# EAGLE design cloak (EAGLE 6.5.0)
Rionita inn - Base board for 700-series
AUTHOR: Niclas Hedhman; REVISION: B
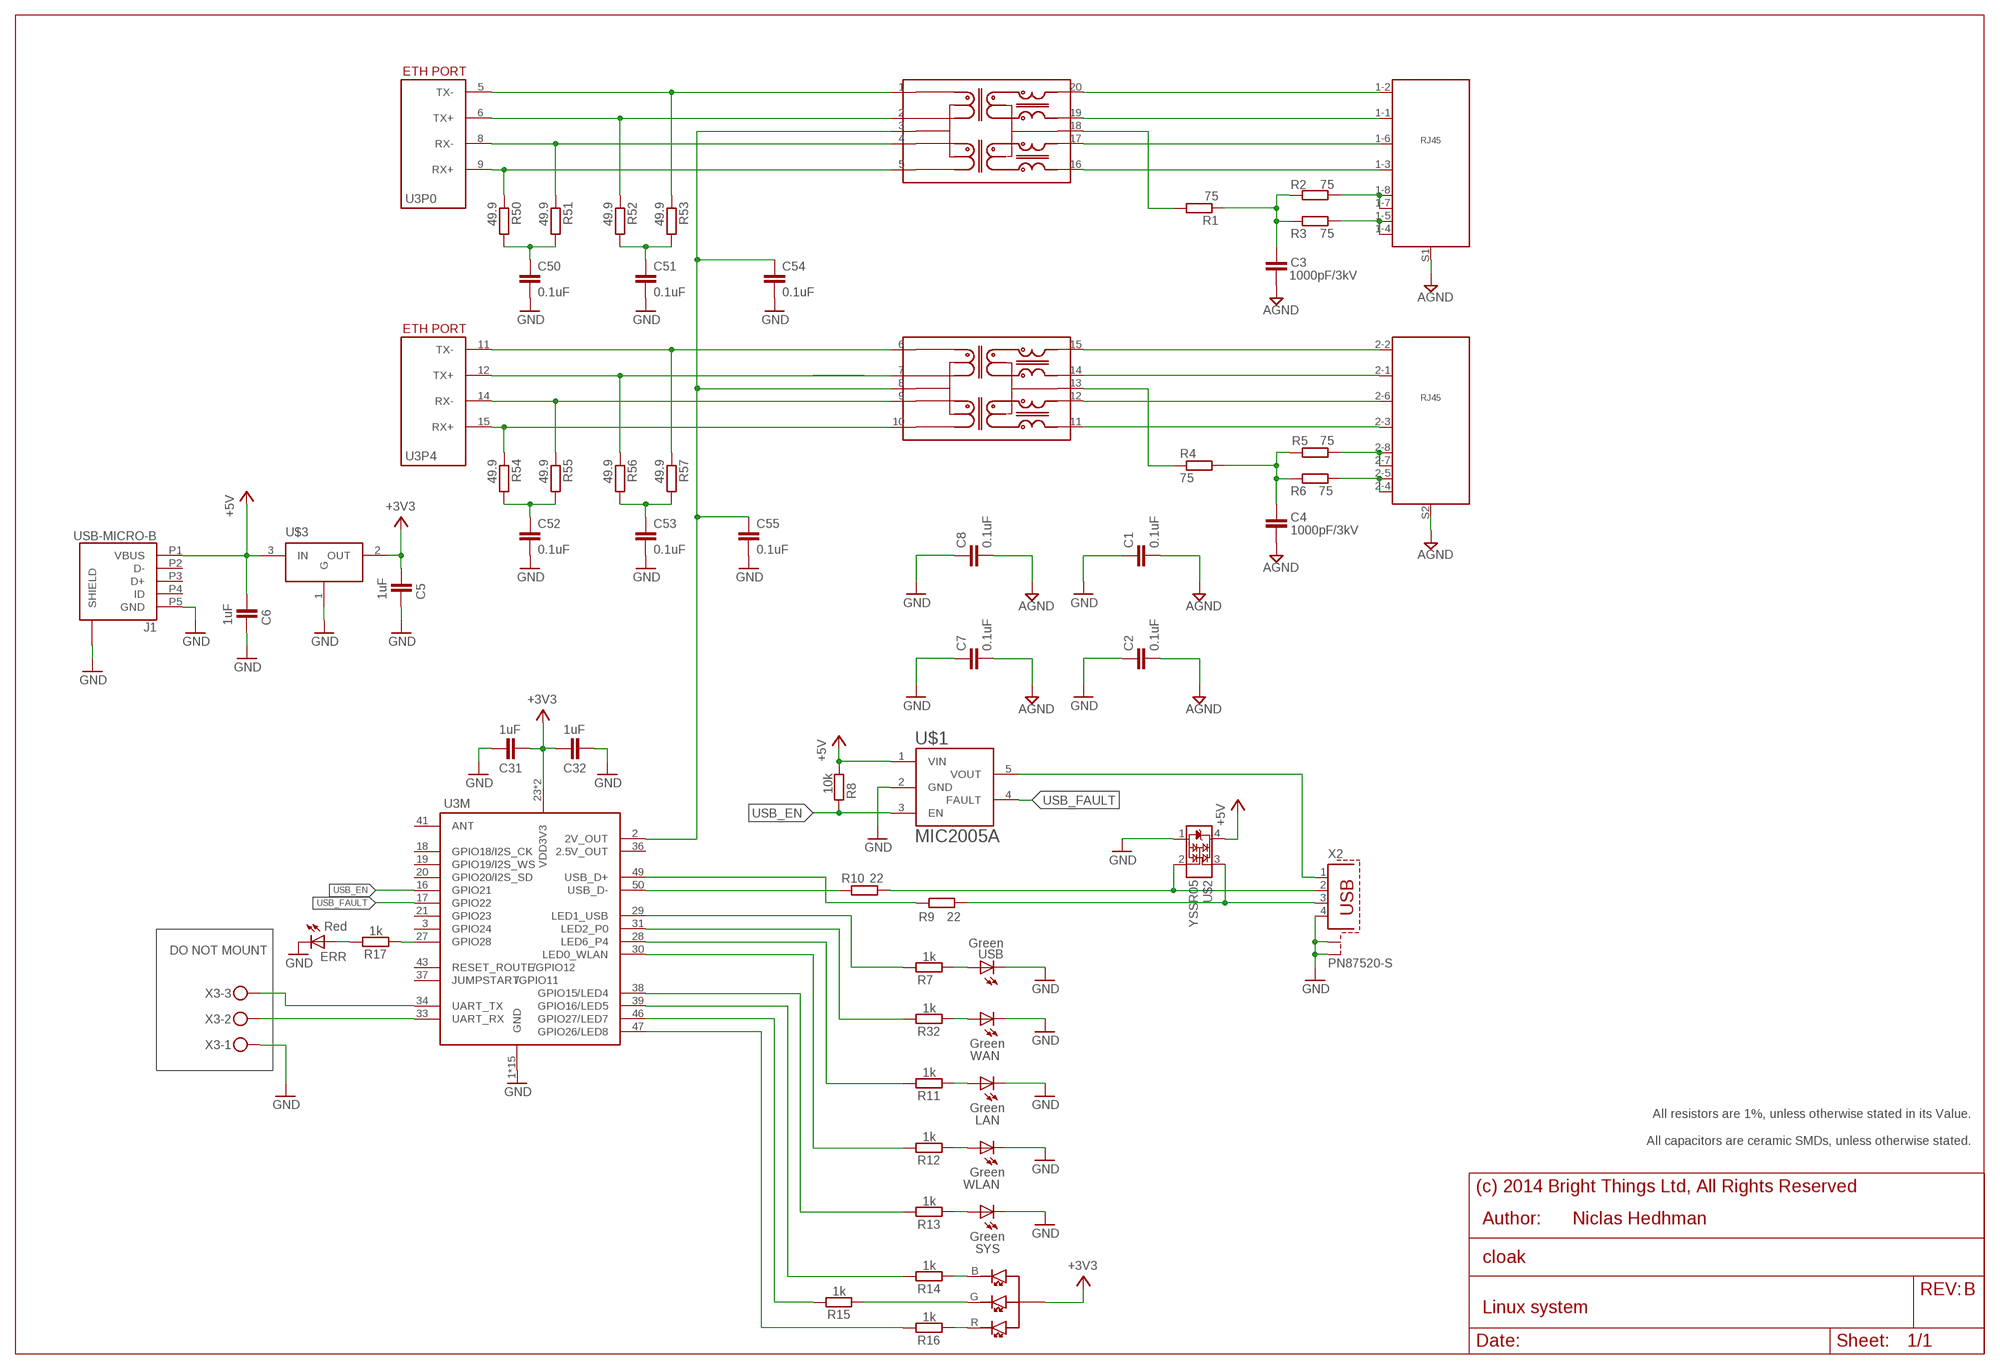
[diagram p0: schematic, sheet 1]
FRAME3 (DINA3_L): SHEET_DESCRIPTION: Linux system

## Parts
C1  0.1uF  C-EUC0603  [C0603]
C2  0.1uF  C-EUC0603  [C0603]
C3  1000pF/3kV  C-EUC1808  [C1808]
C4  1000pF/3kV  C-EUC1808  [C1808]
C5  1uF  C-EUC0603  [C0603]
C6  1uF  C-EUC0603  [C0603]
C7  0.1uF  C-EUC0603  [C0603]
C8  0.1uF  C-EUC0603  [C0603]
C31  1uF  C-EUC0603  [C0603]
C32  1uF  C-EUC0603  [C0603]
C50  0.1uF  C-EUC0603  [C0603]
C51  0.1uF  C-EUC0603  [C0603]
C52  0.1uF  C-EUC0603  [C0603]
C53  0.1uF  C-EUC0603  [C0603]
C54  0.1uF  C-EUC0603  [C0603]
C55  0.1uF  C-EUC0603  [C0603]
CLOAK  LTST-C19FD1WT  [LTST-C19FD1WT]
ERR  Red  LEDCHIP-LED0603  [CHIP-LED0603]
J1  USB-MICRO-B  [CON2_USB_MICRO_B_AT]
LAN  Green  LEDCHIP-LED0603  [CHIP-LED0603]
P4  ETHERNET_2PORT  [SJA-1X2]
R1  75  R-EU_R0805  [R0805]
R2  75  R-EU_R0805  [R0805]
R3  75  R-EU_R0805  [R0805]
R4  75  R-EU_R0805  [R0805]
R5  75  R-EU_R0805  [R0805]
R6  75  R-EU_R0805  [R0805]
R7  1k  R-EU_R0603  [R0603]
R8  10k  R-EU_R0603  [R0603]
R9  22  R-EU_R0805  [R0805]
R10  22  R-EU_R0805  [R0805]
R11  1k  R-EU_R0603  [R0603]
R12  1k  R-EU_R0603  [R0603]
R13  1k  R-EU_R0603  [R0603]
R14  1k  R-EU_R0603  [R0603]
R15  1k  R-EU_R0603  [R0603]
R16  1k  R-EU_R0603  [R0603]
R17  1k  R-EU_R0603  [R0603]
R32  1k  R-EU_R0603  [R0603]
R50  49.9  R-EU_R0805  [R0805]
R51  49.9  R-EU_R0805  [R0805]
R52  49.9  R-EU_R0805  [R0805]
R53  49.9  R-EU_R0805  [R0805]
R54  49.9  R-EU_R0805  [R0805]
R55  49.9  R-EU_R0805  [R0805]
R56  49.9  R-EU_R0805  [R0805]
R57  49.9  R-EU_R0805  [R0805]
SYS  Green  LEDCHIP-LED0603  [CHIP-LED0603]
TR1  HST2038DR  [H2038]
U3  DRAGINO_HE  [DRAGINO_HE]
U$1  MIC2005A  [SOT-23-5]
U$2  YSSR05  [YSSR05]
U$3  LDO_REGL  [SOT23]
USB  Green  LEDCHIP-LED0603  [CHIP-LED0603]
WAN  Green  LEDCHIP-LED0603  [CHIP-LED0603]
WLAN  Green  LEDCHIP-LED0603  [CHIP-LED0603]
X2  PN87520-S  [PN87520-S]
X3  MKDSN1,5/3-5,08  [MKDSN1,5/3-5,08]

## Nets
2V: C54.1 C55.1 TR1.3(CT1) TR1.8(CT1) U3.2(M:2V_OUT)
+3V3 [power]: C5.1 C31.1 C32.1 CLOAK.A U3.23(M:VDD3V3) U3.24(M:VDD3V3) U$3.2(OUT)
+5V: C6.1 J1.P1(VBUS) R8.2 U$1.1(VIN) U$2.4(+) U$3.3(IN)
AGND: C1.2 C2.2 C3.2 C4.2 C7.2 C8.2 P4.S1(SHIELD) P4.S2(SHIELD)
GND: C1.1 C2.1 C5.2 C6.2 C7.1 C8.1 C31.2 C32.2 C50.2 C51.2 C52.2 C53.2 C54.2 C55.2 ERR.C J1.P5(GND) J1.S1(SHIELD) J1.S2(SHIELD) J1.S3(SHIELD) J1.S4(SHIELD) J1.S5(SHIELD) J1.S6(SHIELD) LAN.C SYS.C U3.1(M:GND) U3.4(M:GND) U3.7(M:GND) U3.10(M:GND) U3.13(M:GND) U3.22(M:GND) U3.25(M:GND) U3.26(M:GND) U3.32(M:GND) U3.35(M:GND) U3.40(M:GND) U3.42(M:GND) U3.44(M:GND) U3.45(M:GND) U3.48(M:GND) U$1.2(GND) U$2.1(C) U$3.1(G) USB.C WAN.C WLAN.C X2.4 X2.S1 X2.S2 X3.1
N$1: R32.2 WAN.A
N$2: R7.2 USB.A
N$3: U$1.5(VOUT) X2.1
N$4: R10.2 U3.50(M:USB_D-)
N$5: R9.2 U3.49(M:USB_D+)
N$6: R10.1 U$2.2(B) X2.2
N$7: R9.1 U$2.3(A) X2.3
N$8: LAN.A R11.2
N$9: R12.2 WLAN.A
N$10: R13.2 SYS.A
N$11: CLOAK.B R14.2
N$12: R7.1 U3.29(M:LED1_USB)
N$13: R32.1 U3.31(M:LED2_P0)
N$14: R11.1 U3.28(M:LED6_P4)
N$15: R12.1 U3.30(M:LED0_WLAN)
N$16: R13.1 U3.38(M:LED4)
N$17: R14.1 U3.39(M:LED5)
N$18: CLOAK.G R15.2
N$19: CLOAK.R R16.2
N$20: R15.1 U3.46(M:LED7)
N$21: R16.1 U3.47(M:LED8)
N$22: ERR.A R17.1
N$23: C50.1 R50.2 R51.2
N$24: R17.2 U3.27(M:GPIO28)
N$25: C51.1 R52.2 R53.2
N$27: C52.1 R54.2 R55.2
N$39: C53.1 R56.2 R57.2
N$44: P4.1-2 TR1.20(TX+)
N$45: P4.1-1 TR1.19(TX-)
N$46: P4.1-6 TR1.17(RX+)
N$47: P4.1-3 TR1.16(RX-)
N$60: P4.1-7 P4.1-8 R2.1
N$61: P4.1-4 P4.1-5 R3.1
N$62: P4.2-7 P4.2-8 R5.1
N$63: P4.2-4 P4.2-5 R6.2
N$64: C4.1 R4.2 R5.2 R6.1
N$65: C3.1 R1.1 R2.2 R3.2
N$70: P4.2-2 TR1.15(TX+)
N$71: P4.2-1 TR1.14(TX-)
N$72: P4.2-6 TR1.12(RX+)
N$73: P4.2-3 TR1.11(RX-)
N$74: R4.1 TR1.13(CT2)
N$75: R1.2 TR1.18(CT2)
P0-RX+: R50.1 TR1.5(RD-) U3.9(P0:RX+)
P0-RX-: R51.1 TR1.4(RD+) U3.8(P0:RX-)
P0-TX+: R52.1 TR1.2(TD-) U3.6(P0:TX+)
P0-TX-: R53.1 TR1.1(TD+) U3.5(P0:TX-)
P4-RX+: R54.1 TR1.10(RD-) U3.15(P4:RX+)
P4-RX-: R55.1 TR1.9(RD+) U3.14(P4:RX-)
P4-TX+: R56.1 TR1.7(TD-) U3.12(P4:TX+)
P4-TX-: R57.1 TR1.6(TD+) U3.11(P4:TX-)
RX: U3.33(M:UART_RX) X3.2
TX: U3.34(M:UART_TX) X3.3
USB_EN: R8.1 U3.16(M:GPIO21) U$1.3(EN)
USB_FAULT: U3.17(M:GPIO22) U$1.4(FAULT)
Unconnected: J1.P2(D-) J1.P3(D+) J1.P4(ID) U3.3(M:GPIO24) U3.18(M:GPIO18) U3.19(M:GPIO19) U3.20(M:GPIO20) U3.21(M:GPIO23) U3.37(M:JUMPSTART) U3.41(M:ANT) U3.43(M:RESET_ROUTE)

## Notes on the sheet
- DO NOT MOUNT
- All resistors are 1%, unless otherwise stated in its Value.
  
  All capacitors are ceramic SMDs, unless otherwise stated.

## Power pins joined to a net without a drawn wire
2.5V_OUT: U3.36(M:2.5V_OUT)

## Library data of the parts
C1 C2 C7 C8 = rcl:C-EU: CAPACITOR, European symbol; DIGIKEY: C0603C104K5RAC7411; MANUFACTURER: Kemet; PARTNO: C0603C104K5RAC7411
C3 C4 = rcl:C-EU: CAPACITOR, European symbol; DIGIKEY: 399-7246-2-ND; DIGIKEY_LOW: 399-7246-6-ND; MANUFACTURER: Kemet; PARTNO: C1808C102KHRACTU
C5 C6 C31 C32 = rcl:C-EU: CAPACITOR, European symbol; DIGIKEY: 399-3118-2-ND; DIGIKEY_LOW: 399-3118-6-ND; MF: Kemet; MPN: C0603C105K8PACTU
C50-C55 = rcl:C-EU: CAPACITOR, European symbol; DIGIKEY: 399-7374-2-ND; MF: Kemet; MPN: C0603C104K5RAC7411
CLOAK = RioNet:LTST-C19FD1WT; DIGIKEY: 160-2022-2-ND; MF: Lite-On Inc; MPN: LTST-C19FD1WT
ERR LAN SYS USB WAN WLAN = led:LED: LED OSRAM: - CHIPLED LG R971, LG N971, LY N971, LG Q971, LY Q971, LO R971, LY R971 LH N974, LH R974 LS Q976, LO Q976, LY Q976 LO Q996 - Hyper CHIPLED LW Q18S LB Q993, LB Q99A, LB R99A - SideLED LS A670, LO A670, LY A670, LG A670, LP A670 LB A673, LV A673, LT A673, LW A673 LH A674 LY A675 LS A676, LA A676, LO A676, LY A676, LW A676 LS A679, LY A679, LG A679 - Hyper Micro SIDELED® LS Y876, LA Y876, LO Y876, LY Y876 LT Y87S - SmartLED LW L88C, LW L88S LB L89C, LB L89S, LG L890 LS L89K, LO L89K, LY L89K LS L896, LA L896, LO L896, LY L896 - TOPLED LS T670, LO T670, LY T670, LG T670, LP T670 LSG T670, LSP T670, LSY T670, LOP T670, LYG T670 LG T671, LOG T671, LSG T671 LB T673, LV T673, LT T673, LW T673 LH T674 LS T676, LA T676, LO T676, LY T676, LB T676, LH T676, LSB T676, LW T676 LB T67C, LV T67C, LT T67C, LS T67K, LO T67K, LY T67K, LW E67C LS E67B, LA E67B, LO E67B, LY E67B, LB E67C, LV E67C, LT E67C LW T67C LS T679, LY T679, LG T679 LS T770, LO T770, LY T770, LG T770, LP T770 LB T773, LV T773, LT T773, LW T773 LH T774 LS E675, LA E675, LY E675, LS T675 LS T776, LA T776, LO T776, LY T776, LB T776 LHGB T686 LT T68C, LB T68C - Hyper Mini TOPLED® LB M676 - Mini TOPLED Santana® LG M470 LS M47K, LO M47K, LY M47K Source: http://www.osram.convergy.de LUXEON: - LUMILED® LXK2-PW12-R00, LXK2-PW12-S00, LXK2-PW14-U00, LXK2-PW14-V00 LXK2-PM12-R00, LXK2-PM12-S00, LXK2-PM14-U00 LXK2-PE12-Q00, LXK2-PE12-R00, LXK2-PE12-S00, LXK2-PE14-T00, LXK2-PE14-U00 LXK2-PB12-K00, LXK2-PB12-L00, LXK2-PB12-M00, LXK2-PB14-N00, LXK2-PB14-P00, LXK2-PB14-Q00 LXK2-PR12-L00, LXK2-PR12-M00, LXK2-PR14-Q00, LXK2-PR14-R00 LXK2-PD12-Q00, LXK2-PD12-R00, LXK2-PD12-S00 LXK2-PH12-R00, LXK2-PH12-S00 LXK2-PL12-P00, LXK2-PL12-Q00, LXK2-PL12-R00 Source: www.luxeon.com KINGBRIGHT: KA-3528ASYC Source: www.kingbright.com; DIGIKEY: 475-1410-2-ND; DIGIKEY_LOW: 475-1409-6-ND; MF: OSRAM Opto Semiconductors Inc; MPN: LG Q971-KN-1
J1 = RioNet:USB-MICRO-B
P4 = RioNet:ETHERNET_2PORT
R1-R6 = resistor:R-EU_: RESISTOR, European symbol; DIGIKEY: 541-75.0HTR-ND; DIGIKEY_LOW: 541-75.0HDKR-ND; MANUFACTURER: Vishay Dale; PARTNO: CRCW060375R0FKEA
R7 R11-R17 R32 = rcl:R-EU_: RESISTOR, European symbol; DIGIKEY: 541-1KGTR-ND; DIGIKEY_LOW: 541-1KGDKR-ND; MF: Vishay Dale; MPN: CRCW06031K0JNEA
R8 = rcl:R-EU_: RESISTOR, European symbol; MF: Vishay Dale
R9 R10 = resistor:R-EU_: RESISTOR, European symbol; DIGIKEY: 541-22.0HTR-ND; DIGIKEY_LOW: 541-22.0HDKR-ND; MANUFACTURER: Vishay Dale; PARTNO: CRCW060322R0FKEA
R50-R57 = resistor:R-EU_: RESISTOR, European symbol; DIGIKEY: 541-49.9HTR-ND; DIGIKEY_LOW: 541-49.9HDKR-ND; MF: Vishay Dale; MPN: CRCW060349R9FKEA
TR1 = RioNet:HST2038DR; SUPPLIER: Dragino
U3 = RioNet:DRAGINO_HE: Dragino HE Module
U$1 = RioNet:MIC2005A
U$2 = RioNet:YSSR05: High Speed Protection Diod Array
U$3 = RioNet:LDO_REGL; DIGIKEY: AP2120N-3.3TRG1DITR-ND; MF: Diodes Inc; MPN: AP2120N-3.3TRG1
X2 = con-berg:PN87520-S; OC_FARNELL: unknown; OC_NEWARK: unknown
X3 = con-phoenix-508:MKDSN1,5/3-5,08: MKDSN 1,5/ 3-5,08 Printklemme Nennstrom: 13,5 A Nennspannung: 250 V Rastermaß: 5,08 mm Polzahl: 3 Anschlussart: Schraubanschluss Montage: Löten Anschlussrichtung Leiter/Platine: 0 ° Artikelnummer: 1729131 Source: http://eshop.phoenixcontact.com .. 1729131.pdf; MPN: SMKDSN1,5/3-5,08; OC_FARNELL: 1792904; OC_NEWARK: 70R0299

## Net classes
0 default: width 0.152 mm, drill 0.33 mm, clearance 0.152 mm
1 power: width 0.254 mm, drill 0.61 mm, clearance 0.178 mm
2 gnd: width 0.254 mm, drill 0.61 mm, clearance 0.178 mm
3 usbvcc: width 0.406 mm, drill 0.61 mm, clearance 0.178 mm
4 aref: width 0.254 mm, drill 0.33 mm, clearance 0.152 mm
5 external: width 0.813 mm, drill 1.27 mm, clearance 0.305 mm

## Board
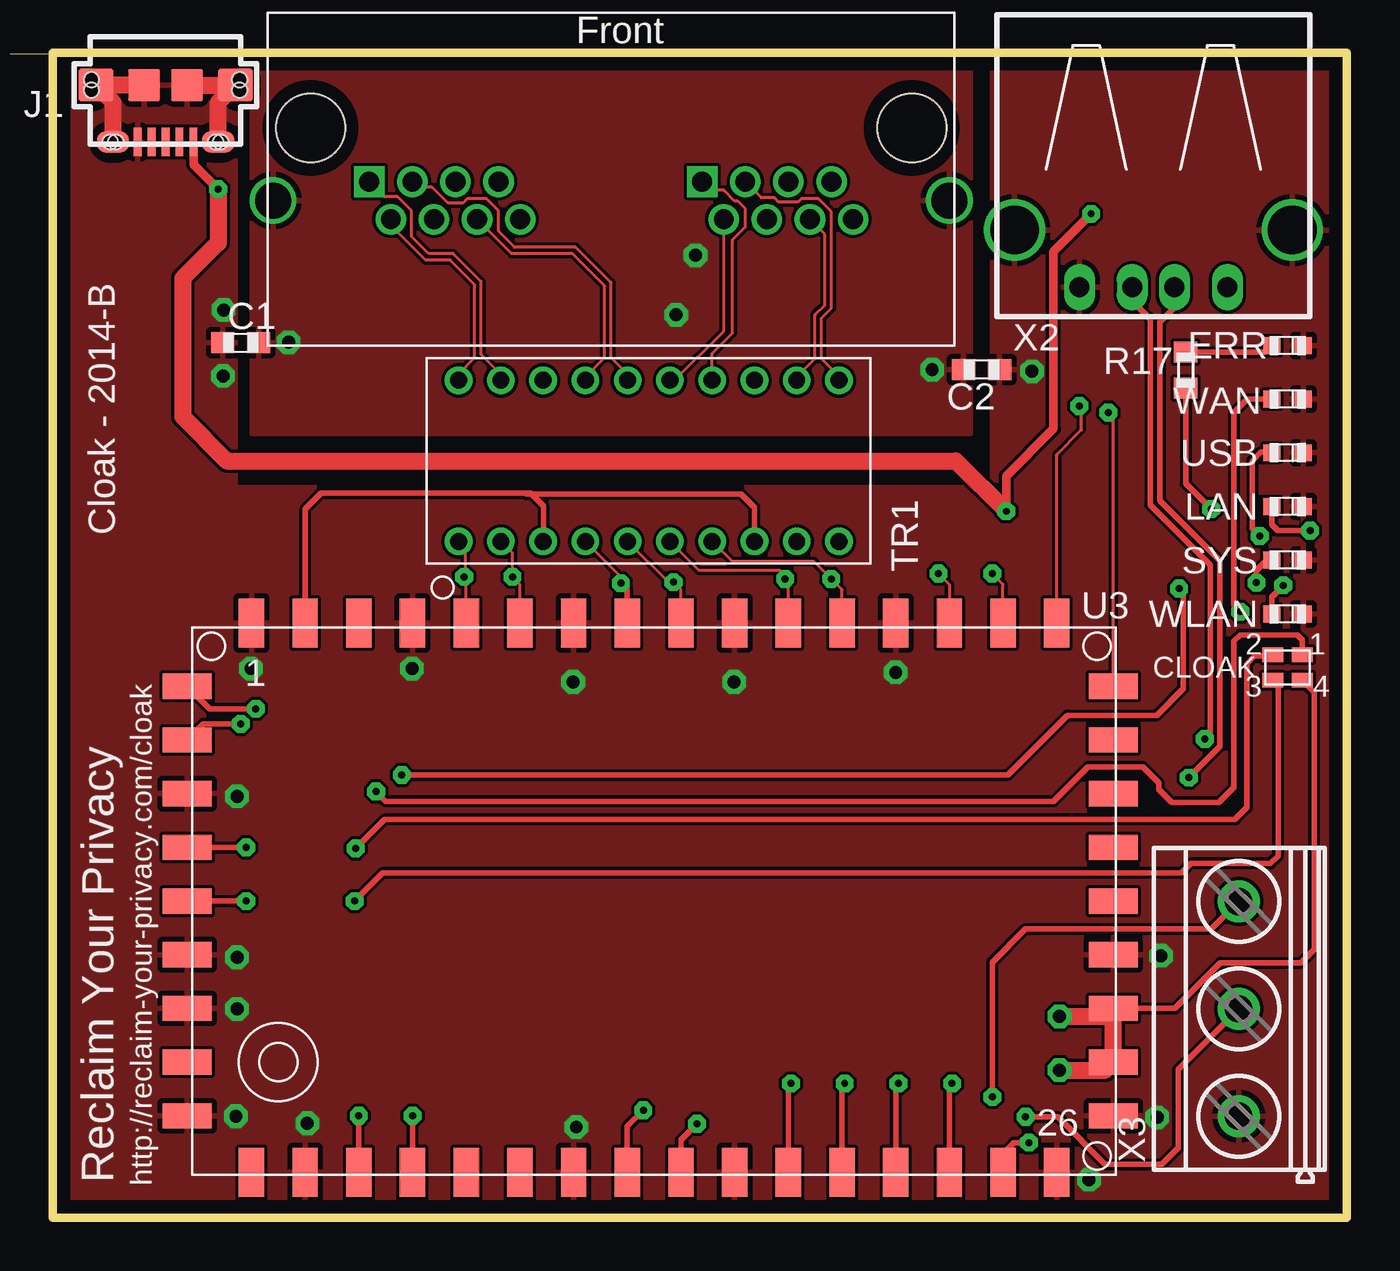
[diagram p1: board, top side]
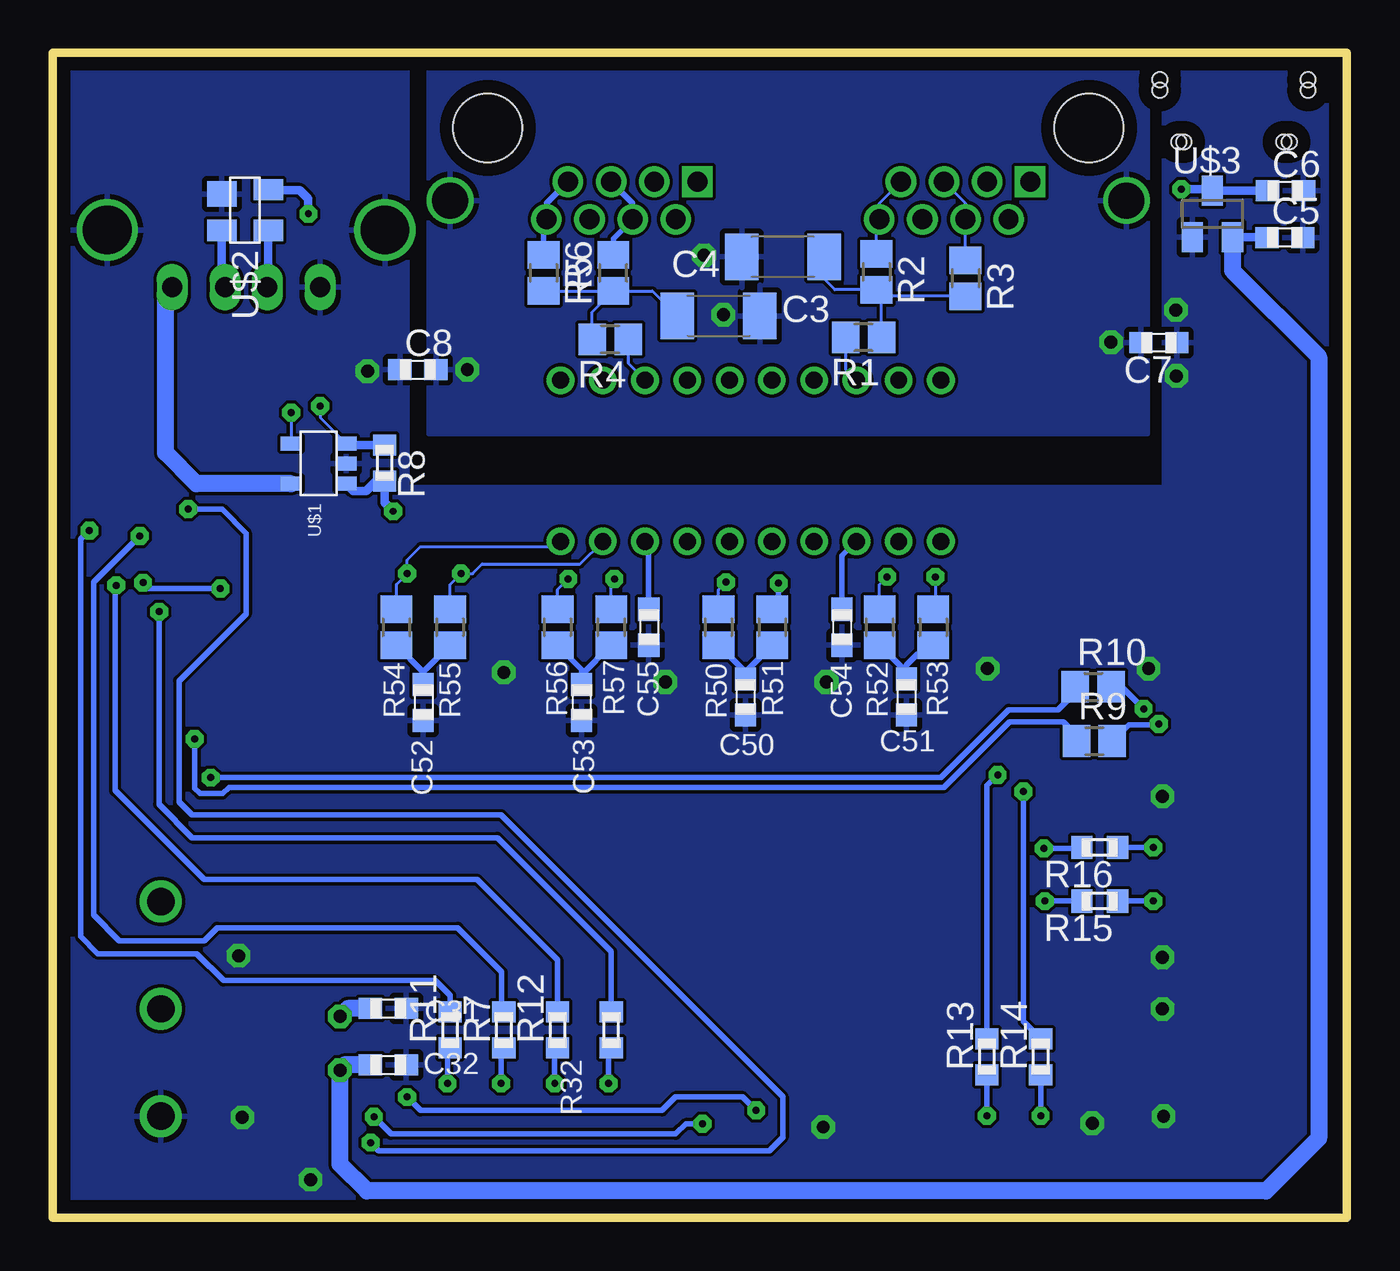
[diagram p2: board, bottom side, seen from below]

Size 61.21 x 55.12 mm. Coordinates in mm from the lower left corner, seen from the top.
Outline: 0,0 61.21,0 61.21,55.12 0,55.12 0,0
Copper layers (1*16): Top 0.035mm / dielectric 1.53mm / Bottom 0.035mm
Design rules "default *": minimum track width 6mil, minimum drill 13mil, track to track 6mil, track to pad 6mil, pad to pad 6mil, via to via 6mil, smd to smd 6mil, copper to edge 25mil, drill to drill 12mil, minimum pad ring 10mil, minimum via ring 10mil, stop-mask expansion 2mil, vias tented up to drill 30mil, thermal gap 10mil
tRestrict: area 125.7,6.1 to 134,13.1; area 88.3,6.2 to 94.5,16.6; area 104.4,13.8 to 108.7,19.4; area 112.5,13.6 to 118.9,14.9; area 111.3,13.6 to 115.8,18.9
bRestrict: area 125.7,6.1 to 134,13.1; area 89.5,6.2 to 94.5,16.3; area 97.5,8.3 to 117.3,19.4

### Footprints (pad centres in the part's own frame; a part is rotated, then mirrored left to right if it is on the bottom)
C0603 = smd 1.1 x 1: 1 -0.85,0; 2 0.85,0
C1808 = smd 1.6 x 2.2: 1 -1.95,0; 2 1.95,0
LTST-C19FD1WT = smd 1 x 0.7: A 0.7,-0.6; B 0.7,0.6; G -0.7,-0.6; R -0.7,0.6
CHIP-LED0603 = smd 0.8 x 0.8: A 0,-0.75; C 0,0.75
CON2_USB_MICRO_B_AT = smd 0.406 x 1.346: P1 -1.321,2.692; P2 -0.66,2.692; P3 0,2.692; P4 0.66,2.692; P5 1.321,2.692 | smd 1.651 x 1.549: S1 -3.302,0; S2 3.302,0 | smd 1.524 x 1.016: S3 -2.489,2.692; S4 2.489,2.692 | smd 1.524 x 1.524: S5 -1.016,0; S6 1.016,0 | hole 0.7: -3.505,0.254; -3.505,-0.254; 3.505,0.254; 3.505,-0.254; -2.616,2.692; -2.362,2.692; 2.362,2.692; 2.616,2.692
SJA-1X2 = drill 0.94 pad 1.27 square: 1-1 11.445,2.54; 2-1 -4.305,2.54 | drill 0.94 pad 1.27: 1-2 10.425,4.32; 1-3 9.405,2.54; 1-4 8.385,4.32; 1-5 7.365,2.54; 1-6 6.345,4.32; 1-7 5.325,2.54; 1-8 4.305,4.32; 2-2 -5.325,4.32; 2-3 -6.345,2.54; 2-4 -7.365,4.32; 2-5 -8.385,2.54; 2-6 -9.405,4.32; 2-7 -10.425,2.54; 2-8 -11.445,4.32 | drill 1.7: S1 16,3.43; S2 -16,3.43 | hole 3.25: -14.225,0; 14.225,0
R0805 = smd 1.3 x 1.5: 1 -0.85,0; 2 0.85,0
R0603 = smd 1 x 1.1: 1 -0.85,0; 2 0.85,0
H2038 = drill 0.8: 1 -3.81,9; 2 -3.81,7; 3 -3.81,5; 4 -3.81,3; 5 -3.81,1; 6 -3.81,-1; 7 -3.81,-3; 8 -3.81,-5; 9 -3.81,-7; 10 -3.81,-9; 11 3.81,-9; 12 3.81,-7; 13 3.81,-5; 14 3.81,-3; 15 3.81,-1; 16 3.81,1; 17 3.81,3; 18 3.81,5; 19 3.81,7; 20 3.81,9
DRAGINO_HE = smd 1.2 x 2.3: 1 -19.05,13.152; 2 -16.51,13.152; 3 -13.97,13.152; 4 -11.43,13.152; 5 -8.89,13.152; 6 -6.35,13.152; 7 -3.81,13.152; 8 -1.27,13.152; 9 1.27,13.152; 10 3.81,13.152; 11 6.35,13.152; 12 8.89,13.152; 13 11.43,13.152; 14 13.97,13.152; 15 16.51,13.152; 16 19.05,13.152; 26 19.05,-12.835; 27 16.51,-12.835; 28 13.97,-12.835; 29 11.43,-12.835; 30 8.89,-12.835; 31 6.35,-12.835; 32 3.81,-12.835; 33 1.27,-12.835; 34 -1.27,-12.835; 35 -3.81,-12.835; 36 -6.35,-12.835; 37 -8.89,-12.835; 38 -11.43,-12.835; 39 -13.97,-12.835; 40 -16.51,-12.835; 41 -19.05,-12.835 | smd 2.3 x 1.2: 17 21.725,10.16; 18 21.725,7.62; 19 21.725,5.08; 20 21.725,2.54; 21 21.725,0; 22 21.725,-2.54; 23 21.725,-5.08; 24 21.725,-7.62; 25 21.725,-10.16; 42 -22.09,-10.16; 43 -22.09,-7.62; 44 -22.09,-5.08; 45 -22.09,-2.54; 46 -22.09,0; 47 -22.09,2.54; 48 -22.09,5.08; 49 -22.09,7.62; 50 -22.09,10.16
SOT-23-5 = smd 0.66 x 1: 1 0.95,1.3; 2 0,1.3; 3 -0.95,1.3; 4 -0.95,-1.3; 5 0.95,-1.3
YSSR05 = smd 1.2 x 1.4: 1 -0.76,-1.1 | smd 1 x 1.4: 2 0.96,-1.1; 3 0.96,1.1; 4 -0.96,1.1
SOT23 = smd 1 x 1.4: 1 -0.95,-1.1; 2 0.95,-1.1; 3 0,1.1
PN87520-S = drill 0.95 long: 1 -3.5,2.71; 2 -1,2.71; 3 1,2.71; 4 3.5,2.71 | drill 2.3 pad 2.9: S1 -6.57,0; S2 6.57,0
MKDSN1,5/3-5,08 = drill 1.3 pad 2: 1 -7.641,0.025; 2 -2.561,0.025; 3 2.519,0.025

### Placement (x,y rotation side)
C1  8.89,41.4 0 top
C2  43.94,40.13 180 top
C3  26.67,45.47 180 bottom
C4  29.72,42.67 0 bottom
C5  2.92,46.38 0 bottom
C6  2.9,48.59 0 bottom
C7  8.89,41.4 180 bottom
C8  43.94,40.13 0 bottom
C31  45.34,9.91 0 bottom
C32  45.34,7.24 0 bottom
C50  28.45,24.64 270 bottom
C51  20.83,24.64 270 bottom
C52  43.69,24.38 270 bottom
C53  36.2,24.38 270 bottom
C54  23.88,27.94 270 bottom
C55  33.02,27.94 270 bottom
CLOAK  58.42,26.04 0 top
ERR  58.42,41.27 270 top
J1  5.33,53.59 180 top
LAN  58.42,33.66 270 top
P4  26.42,51.56 180 top
R1  22.86,41.66 180 bottom
R2  22.25,44.75 270 bottom
R3  18.03,44.45 270 bottom
R4  34.85,41.55 180 bottom
R5  38,44.7 270 bottom
R6  34.7,44.7 90 bottom
R7  39.88,8.89 90 bottom
R8  45.52,35.71 270 bottom
R9  11.94,22.56 0 bottom
R10  11.99,25.12 0 bottom
R11  42.42,8.89 90 bottom
R12  37.34,8.89 90 bottom
R13  17.02,7.62 90 bottom
R14  14.48,7.62 90 bottom
R15  11.68,14.99 180 bottom
R16  11.68,17.53 180 bottom
R17  53.59,40.11 270 top
R32  34.8,8.89 90 bottom
R50  29.72,27.94 270 bottom
R51  27.18,27.94 270 bottom
R52  22.1,27.94 270 bottom
R53  19.56,27.94 270 bottom
R54  44.96,27.94 270 bottom
R55  42.42,27.94 270 bottom
R56  37.34,27.94 270 bottom
R57  34.8,27.94 270 bottom
SYS  58.42,31.11 270 top
TR1  28.19,35.81 90 top
U3  28.45,14.99 0 top
U$1  48.64,35.69 270 bottom
U$2  52.12,47.68 270 bottom
U$3  6.35,47.5 0 bottom
USB  58.42,36.2 270 top
WAN  58.42,38.73 270 top
WLAN  58.42,28.57 270 top
X2  52.07,46.74 180 top
X3  56.13,12.45 90 top

### Tracks (layer width: path | path; a pad name or v marks a point on that pad's centre or on a via)
2V
  Top 0.254: U3.2 11.94,33.53 12.7,34.29 22.35,34.29 | 22.35,34.29 22.61,34.29 23.22,33.68 23.22,32.03 TR1.3 | TR1.8 33.19,33.61 32.56,34.24 22.4,34.24 22.35,34.29
  Bottom 0.254: C54.1 23.88,31.32 TR1.3 | C55.1 33.02,31.83 TR1.8
+3V3  (via drill 0.61)
  Top 0.254: 49.79,6.99 U3.24 | 49.79,9.53 U3.23 53.09,9.91 55.24,12.06 59.05,12.06 59.69,12.7 59.69,24.86 CLOAK.A
  Top 0.813: v47.62,6.99 49.79,6.99 | v47.62,9.53 49.79,9.53 | U3.24 U3.23
  Bottom 0.406: U$3.2 3.79,46.4 C5.1
  Bottom 0.813: C32.1 47.37,7.24 v47.62,6.99 47.62,2.54 46.35,1.27 3.81,1.27 1.32,3.76 1.32,40.74 5.4,44.82 U$3.2 | C31.1 47.24,9.91 v47.62,9.53
+5V  (via drill 0.33)
  Top 0.406: J1.P1 6.66,49.84 v7.82,48.67 | v45.11,33.43 45.11,35.1 47.35,37.34 47.35,45.72 v49.12,47.5
  Top 0.813: v7.82,48.67 7.82,46.13 6.15,44.45 6.15,37.9 8.23,35.81 42.72,35.81 v45.11,33.43
  Bottom 0.406: v7.82,48.67 6.42,48.67 U$3.3 C6.1 | v45.11,33.43 45.52,33.83 R8.2 45.91,34.86 46.38,34.39 47,34.39 U$1.1 | v49.12,47.5 49.12,48.21 49.53,48.62 51,48.62 U$2.4
AGND  (via drill 0.61)
  other vias: 41.61,40.13 30.4,45.54 29.49,42.72 11.15,41.43
  pour Bottom: 9.4,37.08 43.43,37.08 43.43,56.64 9.4,56.64
  pour Top: 9.4,37.08 43.43,37.08 43.43,56.64 9.4,56.64
GND  (via drill 0.61)
  Top 0.813: J1.S5 J1.S1 7.82,52.78 J1.S3 | J1.S6 J1.S2 2.85,52.78 J1.S4
  other vias: 52.43,12.4 52.25,4.75 49.02,1.8 24.77,4.29 12.04,4.47 8.66,4.8 8.71,9.88 8.71,12.32 8.71,19.94 9.37,25.98 16.99,25.98 24.61,25.35 32.23,25.35 39.88,25.81 46.33,40.06 8.08,42.95 8.05,39.83
  pour Bottom: -1.27,-1.27 -1.27,57.15 8.64,57.15 8.64,34.54 44.45,34.54 44.45,57.66 61.72,57.66 61.72,-1.27
  pour Top: -1.27,-2.54 -1.27,56.13 8.64,56.13 8.64,34.54 44.45,34.54 44.45,56.64 62.23,56.9 62.23,-2.29
N$1  (via drill 0.33)
  Top 0.254: v56.19,28.68 55.88,28.98 55.88,38.1 56.52,38.73 WAN.A
  Bottom 0.254: v56.19,28.68 56.19,19.56 54.61,17.98 40.18,17.98 34.8,12.6 R32.2
N$2  (via drill 0.33)
  Top 0.152: 57.65,36.22 USB.A
  Top 0.254: v57.1,32.26 56.74,32.61 56.74,35.81 57.15,36.22 57.65,36.22
  Bottom 0.152: 39.98,9.84 R7.2
  Bottom 0.254: 39.98,9.84 39.98,11.63 42.06,13.72 53.44,13.72 54.05,13.11 58.06,13.11 59.28,14.33 59.28,30.07 v57.1,32.26
N$3
  Bottom 0.813: U$1.5 54.42,34.74 55.88,36.2 55.88,43.72 X2.1
N$4  (via drill 0.33)
  Top 0.254: v9.6,24.08 7.42,24.08 U3.50
  Bottom 0.254: R10.2 10.64,25.12 v9.6,24.08
N$5  (via drill 0.33)
  Top 0.254: v8.89,23.37 7.12,23.37 U3.49
  Bottom 0.254: R9.2 11.07,22.55 10.31,23.32 8.94,23.32 v8.89,23.37
N$6  (via drill 0.33)
  Top 0.254: X2.2 53.07,43.06 52.38,42.37 52.38,33.93 55.22,31.09 55.22,22.3 v53.75,20.83
  Bottom 0.254: v53.75,20.83 19.2,20.83 16,24.03 13.66,24.03 13.11,24.59 13.11,24.85 R10.1 12.86,25.09
  Bottom 0.406: U$2.2 53.22,44.18 X2.2
N$7  (via drill 0.33)
  Top 0.254: X2.3 51.07,43.37 51.92,42.52 51.92,33.73 54.76,30.89 54.76,22.91 v54.51,22.66
  Bottom 0.254: v54.51,22.66 54.51,20.32 54.25,20.07 53.19,20.07 52.88,20.37 19.05,20.37 15.95,23.47 13.41,23.47 13.01,23.06 13.01,22.77 R9.1
  Bottom 0.406: U$2.3 51.02,44.08 X2.3
N$8  (via drill 0.33)
  Top 0.254: LAN.A 57.67,32.8 57.96,32.51 v59.49,32.51
  Bottom 0.254: R11.2 42.42,10.52 43.13,11.23 53.14,11.23 54.41,12.5 59.08,12.5 59.89,13.31 59.89,32.11 v59.49,32.51
N$9  (via drill 0.33)
  Top 0.254: WLAN.A 57.67,29.37 v58.22,29.92
  Bottom 0.254: R12.2 37.34,12.19 41.15,16 54.05,16 58.27,20.22 58.27,29.87 v58.22,29.92
N$10  (via drill 0.33)
  Top 0.152: 53.49,29.57 v53.29,29.77
  Top 0.254: v16.51,20.95 45.19,20.95 48.01,23.77 52.22,23.77 53.49,25.04 53.49,29.57 | SYS.A 57.43,31.11 56.95,30.63 v56.95,30.05
  Bottom 0.254: R13.2 17.02,20.45 v16.51,20.95 | v53.29,29.77 56.72,29.77 56.72,29.82 v56.95,30.05
N$11  (via drill 0.33)
  Top 0.254: v15.29,20.17 15.75,19.71 47.35,19.71 48.97,21.34 51.56,21.34 52.32,20.57 52.32,20.27 52.93,19.66 55.17,19.66 55.88,20.37 55.88,27.28 56.19,27.58 58.88,27.58 59.12,27.34 CLOAK.B
  Bottom 0.254: v15.29,20.17 15.29,9.28 R14.2
N$12  (via drill 0.33)
  Top 0.254: U3.29 39.88,6.22 v40.01,6.35
  Bottom 0.254: v40.01,6.35 40.01,7.91 R7.1
N$13  (via drill 0.33)
  Top 0.254: U3.31 34.8,6.22 v34.92,6.35
  Bottom 0.254: v34.92,6.35 34.92,7.91 R32.1
N$14  (via drill 0.33)
  Top 0.254: U3.28 42.42,6.22 v42.55,6.35
  Bottom 0.254: v42.55,6.35 42.55,7.91 R11.1
N$15  (via drill 0.33)
  Top 0.254: U3.30 37.34,6.22 v37.47,6.35
  Bottom 0.254: v37.47,6.35 37.47,7.91 R12.1
N$16  (via drill 0.33)
  Top 0.254: U3.38 v17.02,4.83
  Bottom 0.254: v17.02,4.83 R13.1
N$17  (via drill 0.33)
  Top 0.254: U3.39 v14.48,4.83
  Bottom 0.254: v14.48,4.83 R14.1
N$18  (via drill 0.33)
  Top 0.152: 57.97,25.18 CLOAK.G
  Top 0.254: v14.28,14.99 15.6,16.31 53.39,16.31 53.85,16.76 57.61,16.76 57.97,17.13 57.97,25.18
  Bottom 0.254: v14.28,14.99 R15.2
N$19  (via drill 0.33)
  Top 0.152: 57.65,26.57 CLOAK.R
  Top 0.254: v14.33,17.48 15.7,18.85 55.93,18.85 56.49,19.41 56.49,26.21 56.84,26.57 57.65,26.57
  Bottom 0.152: 12.59,17.48 R16.2
  Bottom 0.254: v14.33,17.48 12.59,17.48
N$20  (via drill 0.33)
  Top 0.254: U3.46 v9.14,14.99
  Bottom 0.254: v9.14,14.99 R15.1
N$21  (via drill 0.33)
  Top 0.254: U3.47 v9.14,17.53
  Bottom 0.254: v9.14,17.53 R16.1
N$22
  Top 0.254: R17.1 57.35,40.96 ERR.A
N$23
  Bottom 0.254: 28.45,25.82 R51.2 | C50.1 28.45,25.82 | 28.45,25.82 R50.2
N$24  (via drill 0.33)
  Top 0.254: v46.18,3.56 45.47,3.56 45.09,3.17 45.09,2.28 U3.27 | R17.2 53.59,34.75 v54.81,33.53
  Bottom 0.254: v46.18,3.56 45.8,3.17 27.3,3.17 26.67,3.81 26.67,5.71 40.01,19.05 54.61,19.05 55.24,19.68 55.24,25.4 52.07,28.57 52.07,32.38 53.21,33.53 v54.81,33.53
N$25
  Bottom 0.254: R53.2 19.98,26.67 20.32,26.67 20.83,26.16 C51.1 20.83,25.82 R52.2
N$27
  Bottom 0.254: 43.69,25.82 R55.2 | C52.1 43.69,25.82 | 43.69,25.82 R54.2
N$39
  Bottom 0.254: R57.2 36.2,25.69 C53.1 36.2,25.95 R56.2
N$44
  Top 0.152: TR1.20 19.19,39.92 19.96,40.69 19.96,44.15 18.8,45.31 17.63,45.31 16.26,46.69 16.26,46.98 P4.1-2
N$45
  Top 0.152: TR1.19 21.19,39.92 20.27,40.84 20.27,44.3 18.95,45.62 17.78,45.62 16.97,46.43 16.97,47.65 16.31,48.31 15.68,48.31 P4.1-1
N$46
  Top 0.152: TR1.17 25.19,39.77 26.11,40.69 26.11,44.09 24.59,45.62 21.7,45.62 P4.1-6
N$47
  Top 0.152: TR1.16 27.19,39.91 26.42,40.69 26.42,44.25 24.74,45.92 21.84,45.92 21.08,46.69 21.08,47.65 20.52,48.21 19.61,48.21 19.41,48.01 18.69,48.01 17.93,48.77 17.27,48.77 P4.1-3
N$60
  Bottom 0.152: R2.1 22.25,47.1 P4.1-8 22.11,48 P4.1-7
N$61
  Bottom 0.152: R3.1 P4.1-4 18.03,48 P4.1-5
N$62
  Bottom 0.254: R5.1 38,47.1 P4.2-8 37.86,48 P4.2-7
N$63
  Bottom 0.254: R6.2 34.7,46.33 P4.2-4 33.78,48 P4.2-5
N$64
  Bottom 0.152: R5.2 R6.1 | R6.1 32.85,43.85 C4.1 | R4.2 35.7,42.85 R6.1
N$65
  Bottom 0.152: R2.2 24.22,43.91 24.77,44.45 24.77,45.42 C3.1 | R3.2 21.95,43.6 R2.2 | R1.1 22.01,43.66 R2.2
N$70
  Top 0.152: TR1.15 29.41,39.62 31.75,41.96 P4.2-2
N$71
  Top 0.152: TR1.14 31.19,40.9 32.16,41.86 32.16,46.28 32.77,46.89 32.77,47.75 32.41,48.11 32.26,48.11 31.75,48.62 31.13,48.62 P4.2-1
N$72
  Top 0.152: TR1.12 35.19,39.77 36.07,40.64 36.07,42.72 36.52,43.18 36.52,46.54 P4.2-6
N$73
  Top 0.152: TR1.11 37.19,39.82 36.37,40.64 36.37,42.57 36.83,43.03 36.83,47.6 36.22,48.21 35.41,48.21 35.26,48.06 34.34,48.06 34.14,48.26 33.52,48.26 P4.2-3
N$74
  Bottom 0.152: R4.1 34,40.43 TR1.13
N$75
  Bottom 0.152: R1.2 23.71,40.14 TR1.18
P0-RX+  (via drill 0.33)
  Top 0.152: TR1.5 29.12,30.07 v29.36,30.07 29.72,29.72 U3.9
  Bottom 0.152: R50.1 29.72,29.72 v29.36,30.07
P0-RX-  (via drill 0.33)
  Top 0.152: v26.87,30.02 26.87,30.32 TR1.4
  Top 0.254: U3.8 27.18,29.72 v26.87,30.02
  Bottom 0.254: v26.87,30.02 26.87,29.09 R51.1
P0-TX+  (via drill 0.33)
  Top 0.152: TR1.2 21.74,31.46 v21.74,30.33 22.1,29.97 U3.6
  Bottom 0.152: R52.1 22.1,29.97 v21.74,30.33
P0-TX-  (via drill 0.33)
  Top 0.152: U3.5 19.56,30.23 v19.46,30.33 19.51,30.38 19.51,31.6 19.19,31.91 TR1.1
  Bottom 0.152: v19.46,30.33 19.46,28.89 R53.1
P4-RX+  (via drill 0.33)
  Top 0.152: U3.15 44.96,29.97 v44.45,30.48
  Bottom 0.152: R54.1 44.96,29.97 v44.45,30.48 44.45,31.11 43.81,31.75 37.45,31.75 TR1.10
P4-RX-  (via drill 0.33)
  Top 0.152: v41.91,30.48 42.42,29.97 U3.14
  Bottom 0.152: TR1.9 36.26,30.94 40.89,30.94 41.35,30.48 v41.91,30.48 42.42,29.97 R55.1
P4-TX+  (via drill 0.33)
  Top 0.152: TR1.7 32.16,31.04 36.02,31.04 v36.83,30.23 37.34,29.72 U3.12
  Bottom 0.152: R56.1 37.34,29.72 v36.83,30.23
P4-TX-  (via drill 0.33)
  Top 0.152: TR1.6 30.57,30.63 34.39,30.63 34.65,30.38 v34.65,30.23 34.8,30.07 U3.11
  Bottom 0.152: R57.1 34.8,30.07 v34.65,30.23
RX  (via drill 0.33)
  Top 0.254: U3.33 29.72,3.68 v30.48,4.45 | v46.02,4.78 47.55,4.78 49.78,2.54 52.48,2.54 53.24,3.3 53.24,7.01 X3.2
  Bottom 0.254: v30.48,4.45 31.27,4.45 31.75,3.96 45.21,3.96 v46.02,4.78
TX  (via drill 0.33)
  Top 0.254: U3.34 27.18,4.32 v27.94,5.08 | v44.45,5.71 44.45,12.09 46.02,13.66 54.81,13.66 X3.3
  Bottom 0.254: v27.94,5.08 28.57,5.71 31.75,5.71 32.38,5.08 43.81,5.08 v44.45,5.71
USB_EN  (via drill 0.33)
  Top 0.152: U3.16 47.5,36.12 48.67,37.29 48.67,38.3 v48.56,38.41
  Bottom 0.152: v48.56,38.41 48.56,37.86 U$1.3
  Bottom 0.406: R8.1 47.27,36.56 U$1.3
USB_FAULT  (via drill 0.33)
  Top 0.152: U3.17 50.17,37.86 v49.94,38.1
  Bottom 0.152: v49.94,38.1 U$1.4

### Text on the board
tPlace: Cloak - 2014-B | Reclaim Your Privacy | http://reclaim-your-privacy.com/cloak